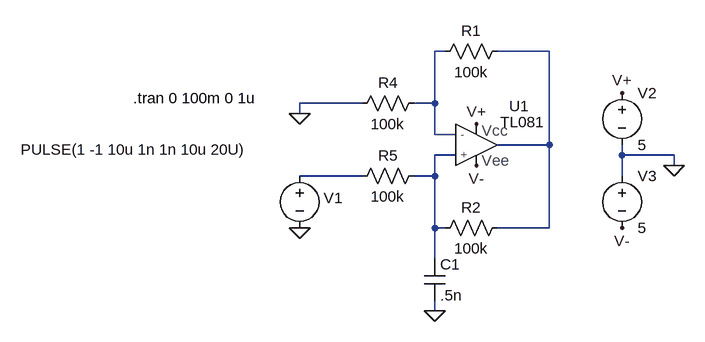
[diagram p0: schematic Schmit integrator CUADRADA.asc]
Schmit integrator CUADRADA.asc, the LTspice schematic file:
Version 4
SHEET 1 880 680
WIRE 160 -16 144 -16
WIRE 320 -16 240 -16
WIRE 32 64 -64 64
WIRE 144 64 144 -16
WIRE 144 64 112 64
WIRE -64 80 -64 64
WIRE 144 112 144 64
WIRE 176 112 144 112
WIRE 320 128 320 -16
WIRE 320 128 240 128
WIRE 176 144 144 144
WIRE 432 144 432 128
WIRE 512 144 432 144
WIRE 512 160 512 144
WIRE 32 176 -64 176
WIRE 144 176 144 144
WIRE 144 176 112 176
WIRE 432 176 432 144
WIRE 144 256 144 176
WIRE 160 256 144 256
WIRE 320 256 320 128
WIRE 320 256 240 256
WIRE 144 304 144 256
WIRE 144 384 144 368
FLAG 512 160 0
FLAG 432 48 V+
FLAG 432 256 V-
FLAG -64 256 0
FLAG 144 384 0
FLAG -64 80 0
FLAG 208 96 V+
FLAG 208 160 V-
SYMBOL voltage -64 160 R0
WINDOW 123 0 0 Left 0
WINDOW 39 0 0 Left 0
WINDOW 0 37 50 Left 2
WINDOW 3 -429 -25 Left 2
SYMATTR InstName V1
SYMATTR Value PULSE(1 -1 10u 1n 1n 10u 20U)
SYMBOL voltage 432 32 R0
WINDOW 123 0 0 Left 0
WINDOW 39 0 0 Left 0
SYMATTR InstName V2
SYMATTR Value 5
SYMBOL voltage 432 160 R0
WINDOW 123 0 0 Left 0
WINDOW 39 0 0 Left 0
SYMATTR InstName V3
SYMATTR Value 5
SYMBOL Agregados\\TL081 208 128 R0
SYMATTR InstName U1
SYMBOL res 256 -32 R90
WINDOW 0 0 56 VBottom 2
WINDOW 3 32 56 VTop 2
SYMATTR InstName R1
SYMATTR Value 100k
SYMBOL res 256 240 R90
WINDOW 0 0 56 VBottom 2
WINDOW 3 32 56 VTop 2
SYMATTR InstName R2
SYMATTR Value 100k
SYMBOL res 128 48 R90
WINDOW 0 0 56 VBottom 2
WINDOW 3 32 56 VTop 2
SYMATTR InstName R4
SYMATTR Value 100k
SYMBOL res 128 160 R90
WINDOW 0 0 56 VBottom 2
WINDOW 3 32 56 VTop 2
SYMATTR InstName R5
SYMATTR Value 100k
SYMBOL cap 128 304 R0
SYMATTR InstName C1
SYMATTR Value .5n
TEXT -320 56 Left 2 !.tran 0 100m 0 1u

The netlist it stands for:
* Schmit integrator CUADRADA.asc
V1 N004 0 PULSE(1 -1 10u 1n 1n 10u 20U)
V2 V+ 0 5
V3 0 V- 5
XU1 N003 N001 V+ V- N002 TL081  ; pins + - ? ? ?
R1 N002 N001 100k
R2 N002 N003 100k
R4 N001 0 100k
R5 N003 N004 100k
C1 N003 0 .5n
.tran 0 100m 0 1u
.lib E:\Descargas\TL081.net
.backanno
.end